# EAGLE design Swarm Board (EAGLE 6.2)
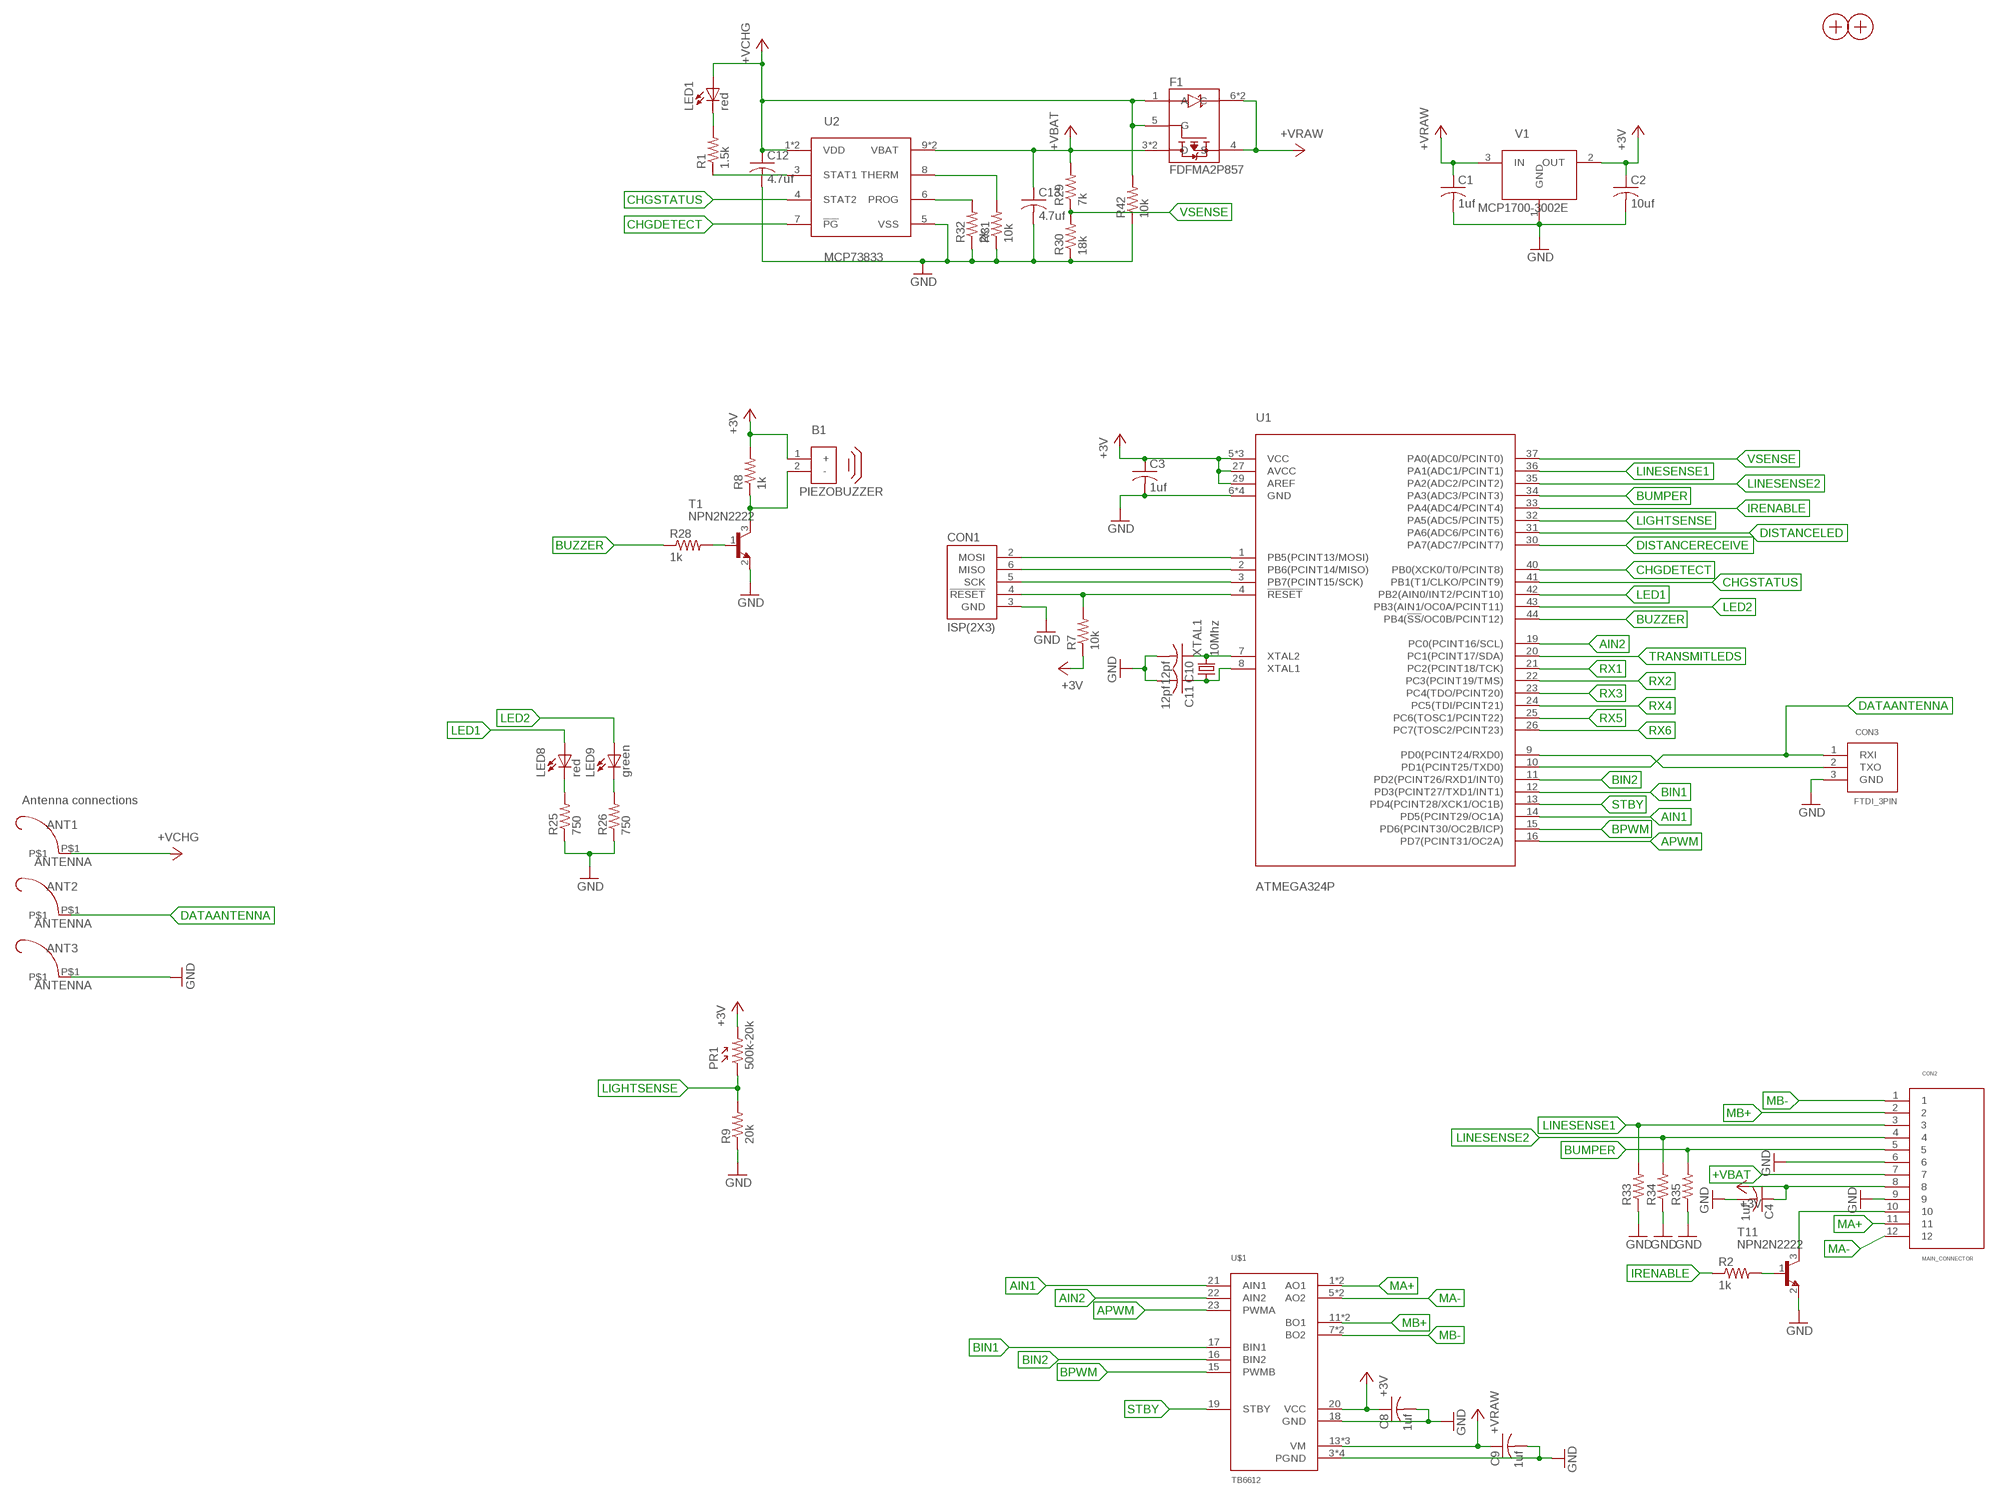
[diagram p0: schematic, sheet 1, part 1 of 2]
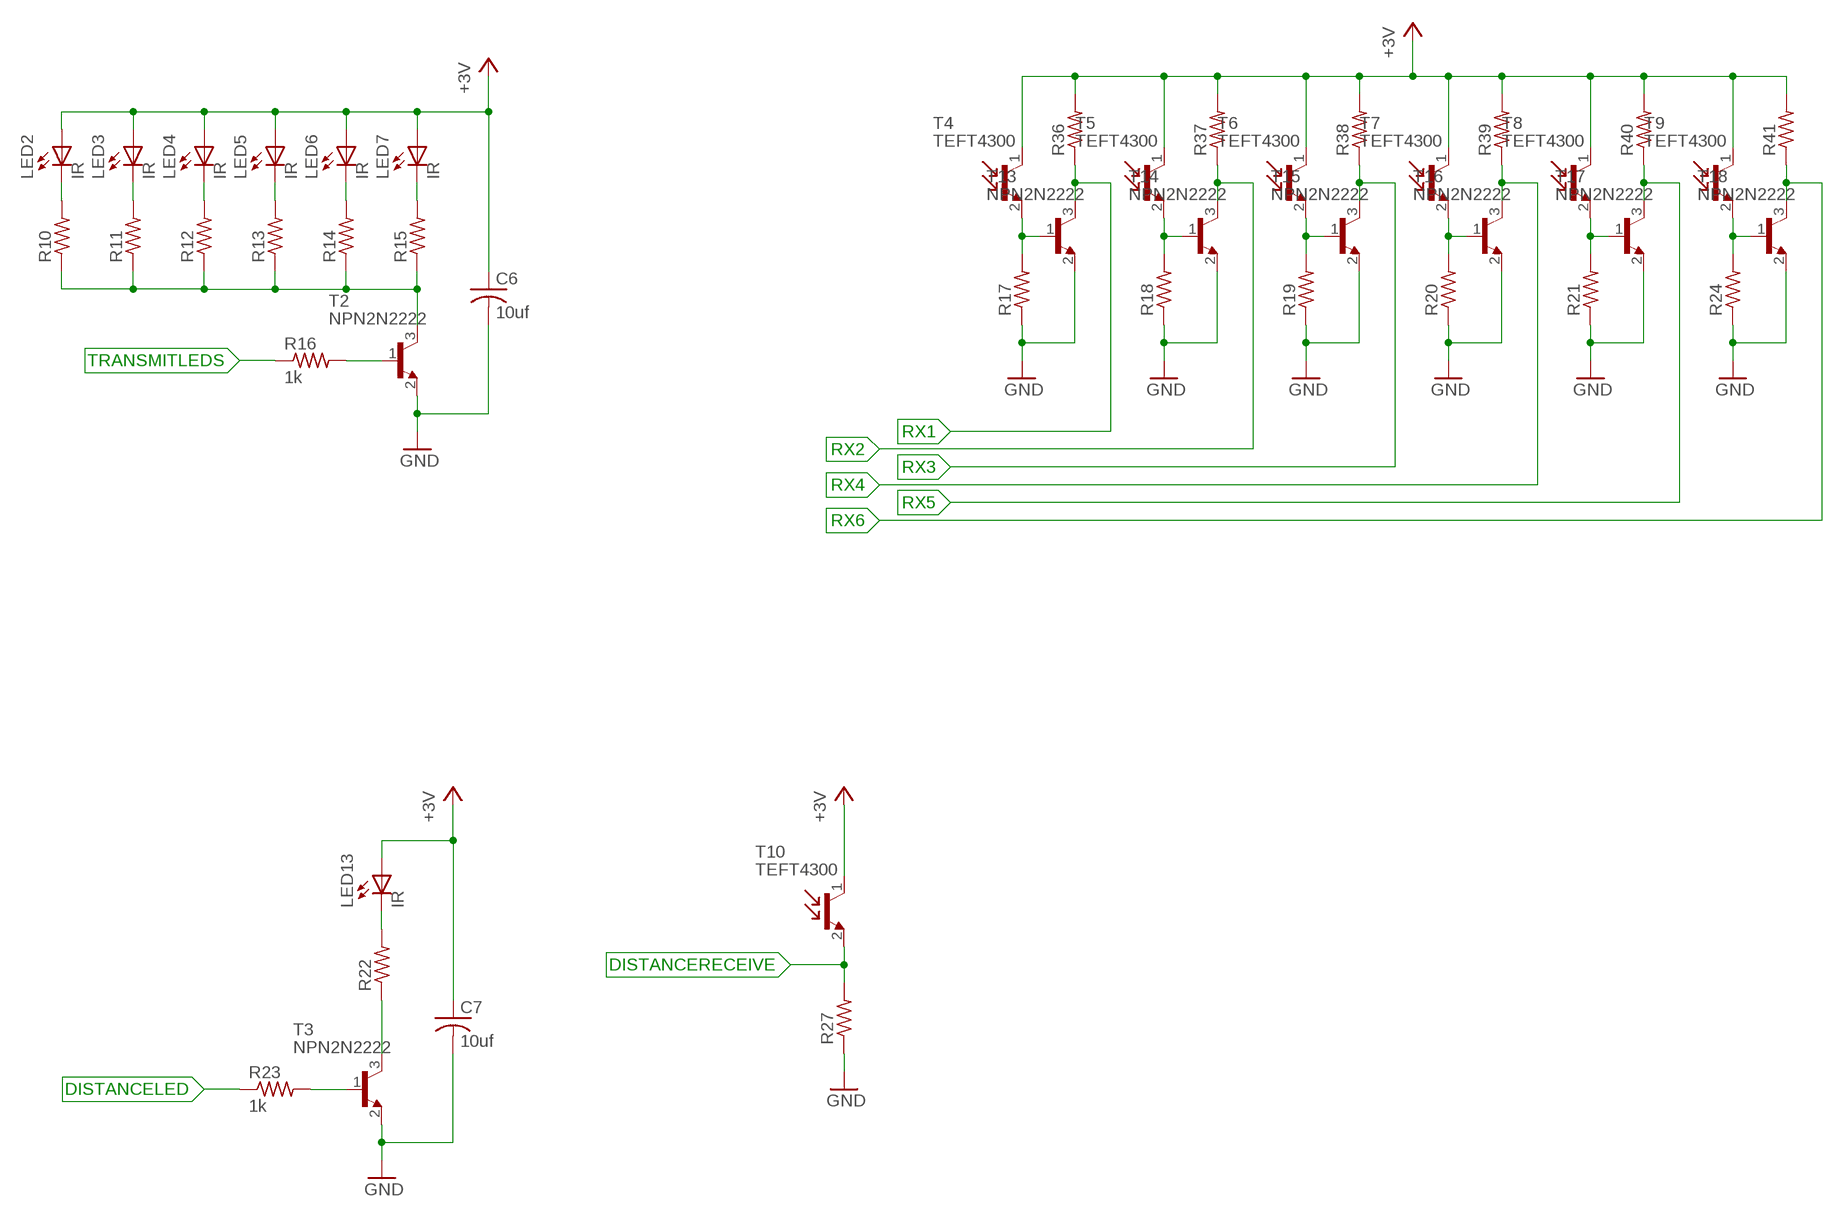
[diagram p1: schematic, sheet 1, part 2 of 2]

## Parts
ANT1  ANTENNA  [ANTENNA]
ANT2  ANTENNA  [ANTENNA]
ANT3  ANTENNA  [ANTENNA]
B1  PIEZOBUZZER  [PIEZOBUZZER]
C1  1uf  CAP0603  [0603]
C2  10uf  CAP0805  [0805]
C3  1uf  CAP0603  [0603]
C4  1uf  CAP0603  [0603]
C6  10uf  CAP0805  [0805]
C7  10uf  CAP0805  [0805]
C8  1uf  CAP0603  [0603]
C9  1uf  CAP0603  [0603]
C10  12pf  CAP0603  [0603]
C11  12pf  CAP0603  [0603]
C12  4.7uf  CAP0603  [0603]
C13  4.7uf  CAP0603  [0603]
CON1  ISP(2X3)  [PINHEADER(2X3)]
CON2  MAIN_CONNECTOR  [FEMALE_HEADER_2MM_2X6]
CON3  FTDI_3PIN  [3PINHEADER_.100"]
F1  FDFMA2P857  [MICROFET2X2MM]
H1  MOUNTINGHOLE  [MOUNTINGHOLE]
H2  MOUNTINGHOLE  [MOUNTINGHOLE]
LED1  red  LED0603  [LED0603]
LED2  IR  LED5MMRA  [5MM_LED_RA]
LED3  IR  LED5MMRA  [5MM_LED_RA]
LED4  IR  LED5MMRA  [5MM_LED_RA]
LED5  IR  LED5MMRA  [5MM_LED_RA]
LED6  IR  LED5MMRA  [5MM_LED_RA]
LED7  IR  LED5MMRA  [5MM_LED_RA]
LED8  red  LED0603  [LED0603]
LED9  green  LED0603  [LED0603]
LED13  IR  LED5MMRA  [5MM_LED_RA]
PR1  500k-20k  CDSPHOTORESISTOR  [CDSPHOTOCELL]
R1  1.5k  RES0603  [0603]
R2  1k  RES0603  [0603]
R7  10k  RES0603  [0603]
R8  1k  RES0603  [0603]
R9  20k  RES0603  [0603]
R10  RES0603  [0603]
R11  RES0603  [0603]
R12  RES0603  [0603]
R13  RES0603  [0603]
R14  RES0603  [0603]
R15  RES0603  [0603]
R16  1k  RES0603  [0603]
R17  RES0603  [0603]
R18  RES0603  [0603]
R19  RES0603  [0603]
R20  RES0603  [0603]
R21  RES0603  [0603]
R22  RES0603  [0603]
R23  1k  RES0603  [0603]
R24  RES0603  [0603]
R25  750  RES0603  [0603]
R26  750  RES0603  [0603]
R27  RES0603  [0603]
R28  1k  RES0603  [0603]
R29  7k  RES0603  [0603]
R30  18k  RES0603  [0603]
R31  10k  RES0603  [0603]
R32  2k  RES0603  [0603]
R33  RES0603  [0603]
R34  RES0603  [0603]
R35  RES0603  [0603]
R36  RES0603  [0603]
R37  RES0603  [0603]
R38  RES0603  [0603]
R39  RES0603  [0603]
R40  RES0603  [0603]
R41  RES0603  [0603]
R42  10k  RES0603  [0603]
T1  NPN2N2222  [SOT23]
T2  NPN2N2222  [SOT23]
T3  NPN2N2222  [SOT23]
T4  TEFT4300  [3MM_LED_RA]
T5  TEFT4300  [3MM_LED_RA]
T6  TEFT4300  [3MM_LED_RA]
T7  TEFT4300  [3MM_LED_RA]
T8  TEFT4300  [3MM_LED_RA]
T9  TEFT4300  [3MM_LED_RA]
T10  TEFT4300  [3MM_LED_RA]
T11  NPN2N2222  [SOT23]
T13  NPN2N2222  [SOT23]
T14  NPN2N2222  [SOT23]
T15  NPN2N2222  [SOT23]
T16  NPN2N2222  [SOT23]
T17  NPN2N2222  [SOT23]
T18  NPN2N2222  [SOT23]
U1  ATMEGA324P  [TQFP44]
U2  MCP73833  [MSOP10]
U$1  TB6612  [24SSOP]
V1  MCP1700-3002E  [(TT/NB)SOT-23(3PAD)]
XTAL1  10Mhz  NX5032GA-10.000000MHZ  [SMDXTAL]

## Nets
+3V: B1.1(+) C2.1 C3.1 C4.1 C6.1 C7.1 C8.1 CON2.8 LED2.1(A) LED3.1(A) LED4.1(A) LED5.1(A) LED6.1(A) LED7.1(A) LED13.1(A) PR1.2 R7.1 R8.2 R36.2 R37.2 R38.2 R39.2 R40.2 R41.2 T4.1(C) T5.1(C) T6.1(C) T7.1(C) T8.1(C) T9.1(C) T10.1(C) U1.5(VCC) U1.17(VCC) U1.27(AVCC) U1.29(AREF) U1.38(VCC) U$1.20(VCC) V1.2(OUT)
+VBAT: C13.1 CON2.7 F1.3(D) F1.8(D) R29.2 U2.9(VBAT) U2.10(VBAT)
+VCHG: ANT1.P$1 C12.1 F1.1(A) F1.5(G) LED1.2(A) R42.2 U2.1(VDD) U2.2(VDD)
+VRAW: C1.1 C9.1 F1.4(S) F1.6(C) F1.7(C) U$1.13(VM) U$1.14(VM) U$1.24(VM) V1.3(IN)
AIN1: U1.14(PD5(PCINT29/OC1A)) U$1.21(AIN1)
AIN2: U1.19(PC0(PCINT16/SCL)) U$1.22(AIN2)
APWM: U1.16(PD7(PCINT31/OC2A)) U$1.23(PWMA)
BIN1: U1.12(PD3(PCINT27/TXD1/INT1)) U$1.17(BIN1)
BIN2: U1.11(PD2(PCINT26/RXD1/INT0)) U$1.16(BIN2)
BPWM: U1.15(PD6(PCINT30/OC2B/ICP)) U$1.15(PWMB)
BUMPER: CON2.5 R35.2 U1.34(PA3(ADC3/PCINT3))
BUZZER: R28.1 U1.44(PB4(!SS!/OC0B/PCINT12))
CHGDETECT: U1.40(PB0(XCK0/T0/PCINT8)) U2.7(!PG)
CHGSTATUS: U1.41(PB1(T1/CLKO/PCINT9)) U2.4(STAT2)
DATAANTENNA: ANT2.P$1 CON3.1(RXI) U1.10(PD1(PCINT25/TXD0))
DISTANCELED: R23.1 U1.31(PA6(ADC6/PCINT6))
DISTANCERECEIVE: R27.2 T10.2(E) U1.30(PA7(ADC7/PCINT7))
GND: ANT3.P$1 C1.2 C2.2 C3.2 C4.2 C6.2 C7.2 C8.2 C9.2 C10.2 C11.2 C12.2 C13.2 CON1.3(GND) CON2.6 CON2.9 CON3.3(GND) R9.1 R17.1 R18.1 R19.1 R20.1 R21.1 R24.1 R25.1 R26.1 R27.1 R30.1 R31.1 R32.1 R33.1 R34.1 R35.1 R42.1 T1.2(E) T2.2(E) T3.2(E) T11.2(E) T13.2(E) T14.2(E) T15.2(E) T16.2(E) T17.2(E) T18.2(E) U1.6(GND) U1.18(GND) U1.28(GND) U1.39(GND) U2.5(VSS) U$1.3(PGND) U$1.4(PGND) U$1.9(PGND) U$1.10(PGND) U$1.18(GND) V1.1(GND)
IRENABLE: R2.1 U1.33(PA4(ADC4/PCINT4))
LED1: LED8.2(A) U1.42(PB2(AIN0/INT2/PCINT10))
LED2: LED9.2(A) U1.43(PB3(AIN1/OC0A/PCINT11))
LIGHTSENSE: PR1.1 R9.2 U1.32(PA5(ADC5/PCINT5))
LINESENSE1: CON2.3 R33.2 U1.36(PA1(ADC1/PCINT1))
LINESENSE2: CON2.4 R34.2 U1.35(PA2(ADC2/PCINT2))
MA+: CON2.11 U$1.1(AO1) U$1.2(AO1)
MA-: CON2.12 U$1.5(AO2) U$1.6(AO2)
MB+: CON2.2 U$1.11(BO1) U$1.12(BO1)
MB-: CON2.1 U$1.7(BO2) U$1.8(BO2)
N$1: LED1.1(C) R1.2
N$2: CON1.2(MOSI) U1.1(PB5(PCINT13/MOSI))
N$3: CON1.6(MISO) U1.2(PB6(PCINT14/MISO))
N$4: R2.2 T11.1(B)
N$5: CON1.5(SCK) U1.3(PB7(PCINT15/SCK))
N$6: CON1.4(!RESET) R7.2 U1.4(!RESET)
N$7: CON2.10 T11.3(C)
N$8: CON3.2(TXO) U1.9(PD0(PCINT24/RXD0))
N$9: B1.2(-) R8.1 T1.3(C)
N$10: R10.1 R11.1 R12.1 R13.1 R14.1 R15.1 T2.3(C)
N$11: R16.2 T2.1(B)
N$12: R22.1 T3.3(C)
N$13: LED2.2(C) R10.2
N$14: LED3.2(C) R11.2
N$15: LED4.2(C) R12.2
N$16: LED5.2(C) R13.2
N$17: LED6.2(C) R14.2
N$18: LED7.2(C) R15.2
N$19: R23.2 T3.1(B)
N$20: LED8.1(C) R25.2
N$21: LED9.1(C) R26.2
N$22: R31.2 U2.8(THERM)
N$23: C10.1 U1.7(XTAL2) XTAL1.2
N$24: C11.1 U1.8(XTAL1) XTAL1.1
N$25: LED13.2(C) R22.2
N$26: R28.2 T1.1(B)
N$27: R17.2 T4.2(E) T13.1(B)
N$28: R32.2 U2.6(PROG)
N$33: R1.1 U2.3(STAT1)
N$34: R24.2 T9.2(E) T18.1(B)
N$35: R21.2 T8.2(E) T17.1(B)
N$36: R20.2 T7.2(E) T16.1(B)
N$37: R19.2 T6.2(E) T15.1(B)
N$38: R18.2 T5.2(E) T14.1(B)
RX1: R36.1 T13.3(C) U1.21(PC2(PCINT18/TCK))
RX2: R37.1 T14.3(C) U1.22(PC3(PCINT19/TMS))
RX3: R38.1 T15.3(C) U1.23(PC4(TDO/PCINT20))
RX4: R39.1 T16.3(C) U1.24(PC5(TDI/PCINT21))
RX5: R40.1 T17.3(C) U1.25(PC6(TOSC1/PCINT22))
RX6: R41.1 T18.3(C) U1.26(PC7(TOSC2/PCINT23))
STBY: U1.13(PD4(PCINT28/XCK1/OC1B)) U$1.19(STBY)
TRANSMITLEDS: R16.1 U1.20(PC1(PCINT17/SDA))
VSENSE: R29.1 R30.2 U1.37(PA0(ADC0/PCINT0))

## Notes on the sheet
- Antenna connections

## Library data of the parts
ANT1-ANT3 = Mechanical:ANTENNA
B1 = Passive:PIEZOBUZZER: Digikey Part Number: 445-2525-1-ND Manufacturer Part Number: PS1240P02BT
C1-C4 C6-C13 = Passive:CAP
CON1 = Mechanical:ISP
CON2 = Mechanical:MAIN_CONNECTOR: Digikey Part Number: S5750-06-ND Manufacturer Part Number: NPPN062AFCN-RC
CON3 = Mechanical:FTDI_3PIN
F1 = Passive:FDFMA2P857: Digikey Part Number: FDFMA2P857CT-ND Manufacturer Part Number: FDFMA2P857
H1 H2 = Mechanical:MOUNTINGHOLE
LED1-LED9 LED13 = Passive:LED
PR1 = Passive:CDSPHOTORESISTOR: Digikey Part Number: PDV-P8103-ND Manufacturer Part Number: PDV-P8103
R1 R2 R7-R42 = Passive:RES
T1-T3 T11 T13-T18 = Passive:NPN2N2222: Digikey Part Number: 568-1738-1-ND Manufacturer Part Number: PMBT2222A,215
T4-T10 = Passive:TEFT4300: Digikey Part Number: 751-1041-ND Manufacturer Part number: TEFT4300
U1 = DigitalIC:ATMEGA324P: Digikey Part Number: ATMEGA324P-20AU-ND Manufacturer Part Number: ATMEGA324P-20AU
U2 = PowerIC:MCP73833: Manufacturer Part Number: MCP73833-AMI/UN Mouser Part Number: 579-MCP73833-AMI/UN
U$1 = DigitalIC:TB6612
V1 = PowerIC:MCP1700-3002E: Digikey Part Number: MCP1700T-3002E/TTCT-ND Manufacturer Part Number: MCP1700T-3002E/TT
XTAL1 = Passive:NX5032GA-10.000000MHZ: Digikey Part Number: 644-1033-1-ND Manufacturer Part Number: NX5032GA-10.000000MHZ-LN-CD-1

## Board
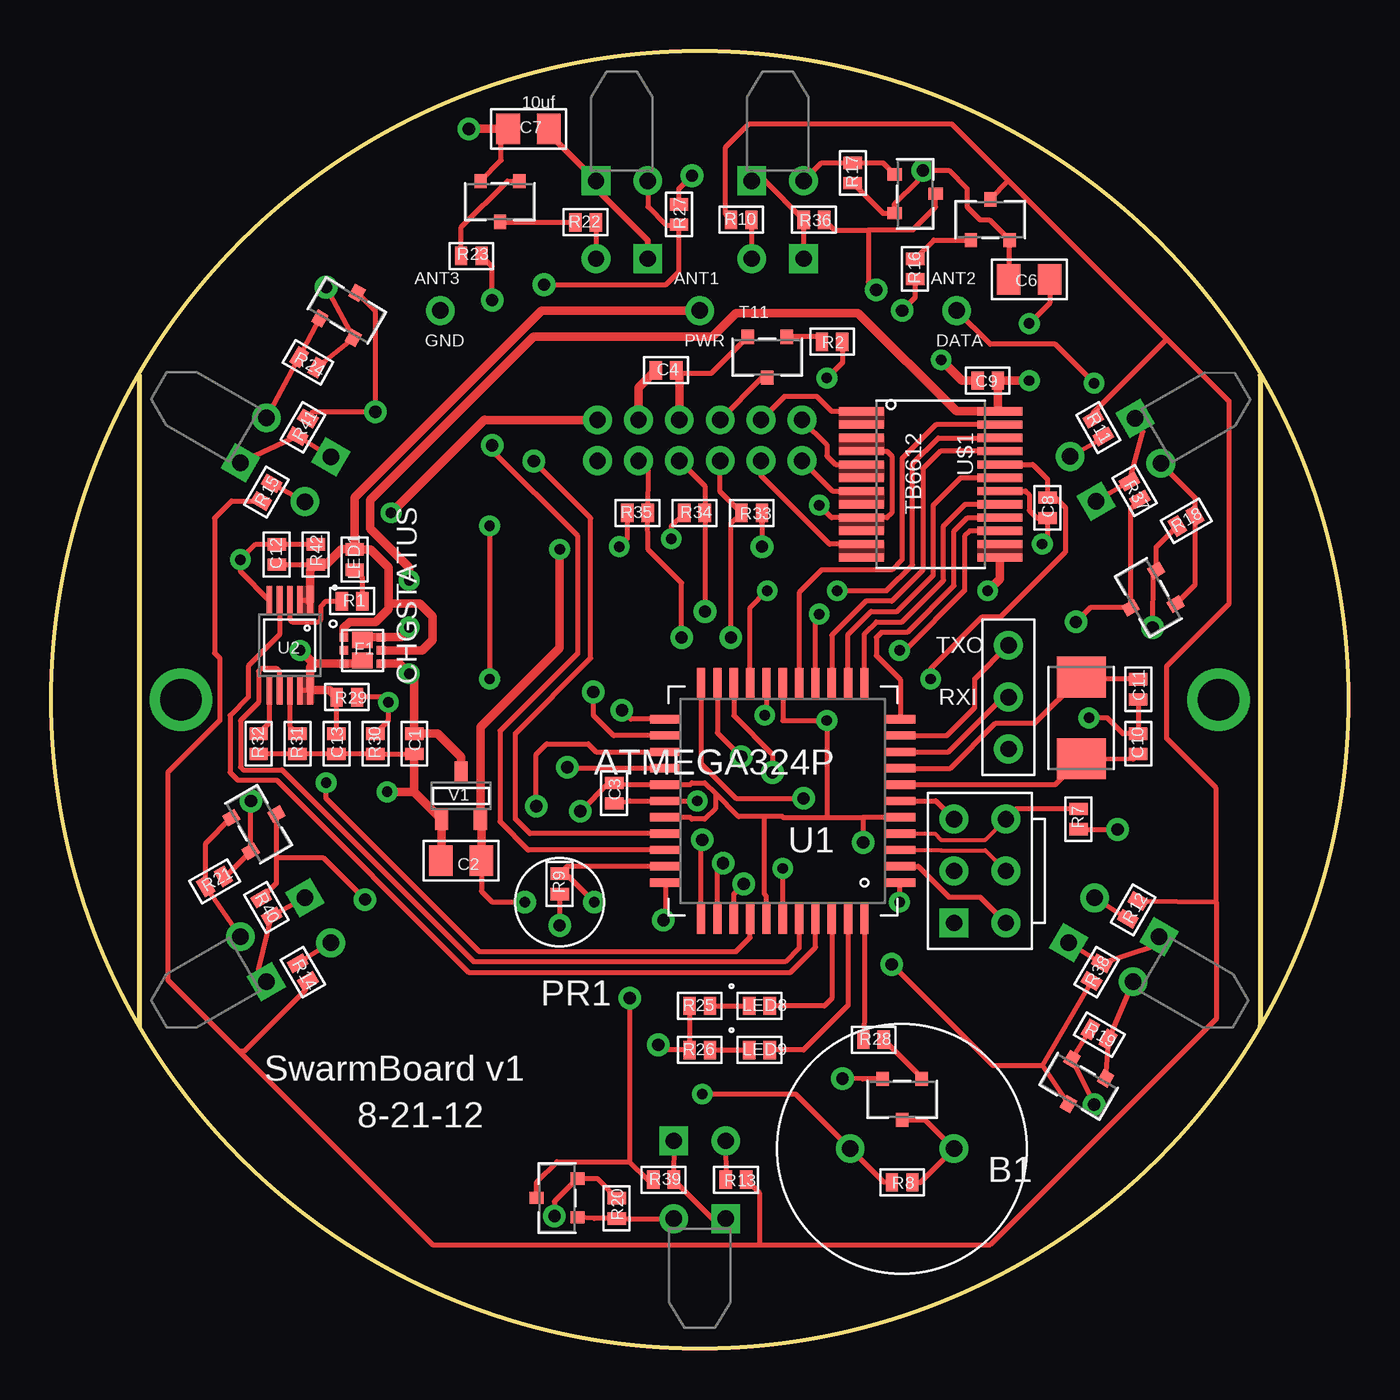
[diagram p2: board, top side]
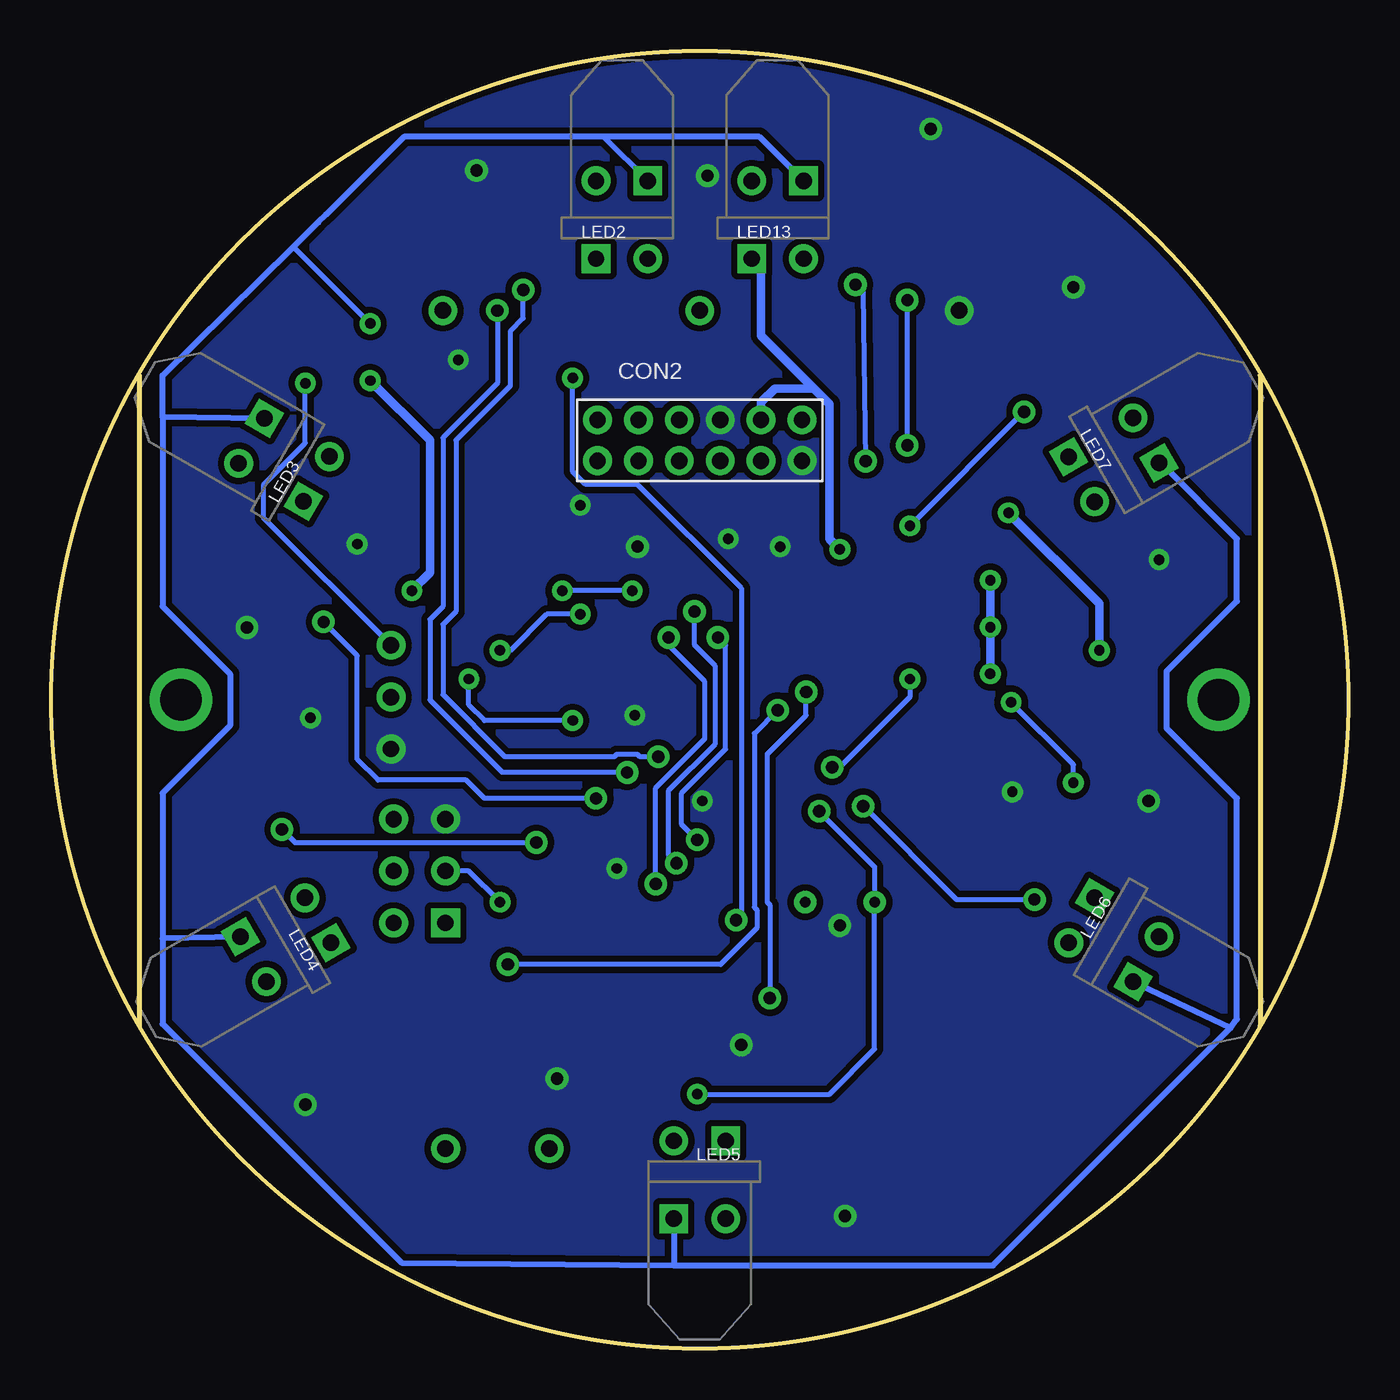
[diagram p3: board, bottom side, seen from below]

Size 63.5 x 63.5 mm. Coordinates in mm from the lower left corner, seen from the top.
Outline: 4.32,47.62 4.32,15.8
Outline: 59.18,47.62 59.18,15.8
Outline: circle at 31.75,31.75 radius 31.75
Copper layers (1*16): Top 0.035mm / dielectric 1.5mm / Bottom 0.035mm
Design rules: minimum track width 8mil, minimum drill 20mil, track to track 8mil, track to pad 8mil, pad to pad 8mil, via to via 8mil, smd to smd 8mil, copper to edge 10mil, drill to drill 8mil, minimum pad ring 12mil, minimum via ring 10mil, stop-mask expansion 4mil, vias tented up to drill 25mil, thermal gap 10mil

### Footprints (pad centres in the part's own frame; a part is rotated, then mirrored left to right if it is on the bottom)
ANTENNA = drill 0.8: P$1 0,0
PIEZOBUZZER = drill 0.8: 1 -2.54,0; 2 2.54,0
0603 = smd 0.6 x 0.9: 1 -0.5,0; 2 0.5,0
0805 = smd 1.15 x 1.5: 1 -1,0; 2 1,0
PINHEADER(2X3) = drill 0.8 square: 1 -2.54,1.27 | drill 0.8: 2 0,1.27; 3 2.54,1.27; 4 2.54,-1.27; 5 0,-1.27; 6 -2.54,-1.27
FEMALE_HEADER_2MM_2X6 = drill 0.8: 1 -5,-1; 2 -3,-1; 3 -1,-1; 4 1,-1; 5 3,-1; 6 5,-1; 7 5,1; 8 3,1; 9 1,1; 10 -1,1; 11 -3,1; 12 -5,1
3PINHEADER_.100" = drill 0.8: 1 -2.54,0; 2 0,0; 3 2.54,0
MICROFET2X2MM = smd 0.42 x 0.42: 1 -0.65,-0.915; 2 0,-0.915; 3 0.65,-0.915; 4 0.65,0.915; 5 0,0.915; 6 -0.65,0.915 | smd 0.78 x 1: 7 -0.5,0; 8 0.5,0
MOUNTINGHOLE = drill 2.032 pad 2.286: P$2 0,0
LED0603 = smd 0.6 x 0.9: 1 -0.5,0; 2 0.5,0
5MM_LED_RA = drill 0.8 square: 1 -1.27,0 | drill 0.8: 2 1.27,0
CDSPHOTOCELL = drill 0.508: 1 -1.694,0; 2 1.702,0
SOT23 = smd 0.6 x 0.7: 1 0.95,1; 2 -0.95,1; 3 0,-1
3MM_LED_RA = drill 0.8 square: 1 -1.27,0 | drill 0.8: 2 1.27,0
TQFP44 = smd 1.5 x 0.406: 1 -5.75,4; 2 -5.75,3.2; 3 -5.75,2.4; 4 -5.75,1.6; 5 -5.75,0.8; 6 -5.75,0; 7 -5.75,-0.8; 8 -5.75,-1.6; 9 -5.75,-2.4; 10 -5.75,-3.2; 11 -5.75,-4; 23 5.75,-4; 24 5.75,-3.2; 25 5.75,-2.4; 26 5.75,-1.6; 27 5.75,-0.8; 28 5.75,0; 29 5.75,0.8; 30 5.75,1.6; 31 5.75,2.4; 32 5.75,3.2; 33 5.75,4 | smd 0.406 x 1.5: 12 -4,-5.75; 13 -3.2,-5.75; 14 -2.4,-5.75; 15 -1.6,-5.75; 16 -0.8,-5.75; 17 0,-5.75; 18 0.8,-5.75; 19 1.6,-5.75; 20 2.4,-5.75; 21 3.2,-5.75; 22 4,-5.75; 34 4,5.75; 35 3.2,5.75; 36 2.4,5.75; 37 1.6,5.75; 38 0.8,5.75; 39 0,5.75; 40 -0.8,5.75; 41 -1.6,5.75; 42 -2.4,5.75; 43 -3.2,5.75; 44 -4,5.75
MSOP10 = smd 0.28 x 1.4: 1 -1,-2.2; 2 -0.5,-2.2; 3 0,-2.2; 4 0.5,-2.2; 5 1,-2.2; 6 1,2.2; 7 0.5,2.2; 8 0,2.2; 9 -0.5,2.2; 10 -1,2.2
24SSOP = smd 0.4 x 2.2: 1 -3.575,-3.378; 2 -2.925,-3.378; 3 -2.275,-3.378; 4 -1.625,-3.378; 5 -0.975,-3.378; 6 -0.325,-3.378; 7 0.325,-3.378; 8 0.975,-3.378; 9 1.625,-3.378; 10 2.275,-3.378; 11 2.925,-3.378; 12 3.575,-3.378; 13 3.575,3.378; 14 2.925,3.378; 15 2.275,3.378; 16 1.625,3.378; 17 0.975,3.378; 18 0.325,3.378; 19 -0.325,3.378; 20 -0.975,3.378; 21 -1.625,3.378; 22 -2.275,3.378; 23 -2.925,3.378; 24 -3.575,3.378
(TT/NB)SOT-23(3PAD) = smd 0.65 x 1.05: 1 -0.95,-1.15; 2 0.95,-1.15; 3 0,1.15
SMDXTAL = smd 2 x 2.4: 1 -2,0; 2 2,0

### Placement (x,y rotation side)
ANT1  31.75,50.8 0 top
ANT2  44.32,50.8 0 top
ANT3  19.05,50.8 0 top
B1  41.66,9.78 0 top
C1  17.78,29.59 270 top
C2  20.07,23.88 180 top
C3  27.56,27.18 270 top
C4  30.1,47.88 0 top
C6  47.88,52.32 180 top
C7  23.37,59.69 180 top
C8  48.77,41.15 270 top
C9  45.85,47.37 180 top
C10  53.21,29.59 90 top
C11  53.21,32.26 270 top
C12  11.05,38.86 90 top
C13  13.97,29.59 270 top
CON1  45.47,23.37 90 top
CON2  31.75,44.45 0 bottom
CON3  46.86,31.88 270 top
F1  15.24,34.16 270 top
H1  6.35,31.75 0 top
H2  57.15,31.75 0 top
LED1  14.86,38.61 90 top
LED2  35.56,53.34 0 bottom
LED3  50.51,42.56 60 bottom
LED4  50.44,20.95 120 bottom
LED5  31.75,10.16 180 bottom
LED6  13.06,20.95 240 bottom
LED7  13.06,42.55 300 bottom
LED8  34.67,16.76 0 top
LED9  34.67,14.61 0 top
LED13  27.94,53.34 0 bottom
PR1  24.89,21.84 180 top
R1  14.73,36.58 0 top
R2  38.23,49.28 180 top
R7  50.29,25.91 90 top
R8  41.66,8.13 180 top
R9  24.89,22.73 90 top
R10  33.78,55.24 0 top
R11  51.26,45.07 300 top
R12  52.96,21.46 240 top
R13  33.53,8.26 180 top
R14  12.32,18.41 120 top
R15  10.54,41.91 60 top
R16  42.29,52.83 90 top
R17  39.24,57.53 90 top
R18  55.56,40.51 30 top
R19  51.31,15.37 330 top
R20  27.69,6.86 270 top
R21  8,22.86 210 top
R22  26.16,55.12 0 top
R23  20.57,53.47 180 top
R24  12.57,48.26 150 top
R25  31.75,16.76 0 top
R26  31.75,14.61 0 top
R27  30.73,55.5 270 top
R28  40.26,15.11 0 top
R29  14.48,31.88 180 top
R30  15.88,29.59 90 top
R31  12.06,29.59 90 top
R32  10.16,29.59 90 top
R33  34.29,40.89 180 top
R34  31.5,40.89 0 top
R35  28.7,40.89 0 top
R36  37.34,55.24 180 top
R37  53.04,41.99 120 top
R38  51.18,18.41 60 top
R39  29.97,8.26 0 top
R40  10.54,21.59 300 top
R41  12.32,45.09 240 top
R42  12.95,38.86 270 top
T1  41.66,12.19 0 top
T2  45.97,55.24 180 top
T3  21.97,56.13 0 top
T4  35.56,57.15 0 top
T5  53.69,44.42 300 top
T6  53.59,19.05 240 top
T7  31.75,6.35 180 top
T8  9.91,19.05 120 top
T9  9.91,44.45 60 top
T10  27.94,57.15 0 top
T11  35.05,48.51 0 top
T13  42.29,56.52 90 top
T14  53.71,36.75 300 top
T15  50.29,12.83 330 top
T16  24.77,7.37 270 top
T17  10.16,25.65 120 top
T18  14.48,50.8 150 top
U1  35.81,26.8 180 top
U2  11.68,34.42 180 top
U$1  43.05,42.29 270 top
V1  20.07,27.05 0 top
XTAL1  50.42,30.86 270 top

### Tracks (layer width: path | path; a pad name or v marks a point on that pad's centre or on a via)
+3V  (via drill 0.51, 0.6 pad 0.41)
  Top 0.254: 32.51,27.18 32,27.69 31.37,27.69 31.28,27.6 U1.27 28.27,27.6 C3.1 27.3,27.68 v25.91,26.29 | 32.51,27.18 32.51,26.42 32,25.91 31.37,25.91 31.28,26 U1.29 | 32.51,27.18 33.66,26.04 34.92,26.04 | 37.97,26 35.81,26 35.81,26.04 34.92,26.04 | 37.97,26 39.75,26 | U1.38 35.01,22.14 34.92,22.23 34.92,26.04 | LED2.1 R36.2 34.93,57.15 T4.1 | LED3.1 51.15,41.48 R37.2 53.44,44.85 T5.1 | LED4.1 R38.2 53.98,19.68 T6.1 | LED5.1 R39.2 32.38,6.35 T7.1 | LED6.1 R40.2 10.16,18.54 T8.1 | LED7.1 R41.2 T9.1 | R8.2 40.76,8.14 B1.1 36.45,12.45 v31.88,12.45 | U1.5 39.75,26 | R7.1 v52.2,25.4 | v39.75,24.77 39.75,26 | 37.97,26 v37.97,30.73 35.81,30.73 U1.17 | C2.1 21.07,22.37 21.59,21.84 PR1.2 | C6.1 48.88,51.16 v47.88,50.16 | v43.05,32.77 43.05,33.27 45.59,35.81 46.48,35.81 49.66,38.99 49.66,41.15 49.16,41.65 C8.1 48.77,42.55 48.05,43.27 U$1.20
  Top 0.305: LED13.1 29.21,54.23 26.67,56.77 T10.1 24.51,59.31 C7.1
  Top 0.406: CON2.8 28.75,47.03 C4.1 | v24.89,39.12 24.89,34.29 21.02,30.41 V1.2 21.07,25.85 C2.1
  Bottom 0.254: 36.45,59.31 T4.1 | 9.19,43.35 T9.1 | v52.2,25.4 51.56,24.77 v39.75,24.77 | v25.91,26.29 23.19,23.57 PR1.2 23.19,14.66 25.4,12.45 v31.88,12.45 | v47.88,50.16 51.57,53.85 51.7,53.85 | v37.97,30.73 42.29,30.73 43.05,31.5 v43.05,32.77
  Bottom 0.305: T10.1 28.83,59.31 36.45,59.31 46.23,59.31 50.04,55.5 50.42,55.12 51.7,53.85 58.04,47.62 58.04,45.59 | 58.04,45.59 58.04,36.32 54.74,33.02 54.74,30.48 58.04,27.18 58.04,20.07 | 58.04,20.07 58.04,15.88 46.35,4.19 33.02,4.06 | 33.02,4.06 17.4,4.06 5.78,15.68 | 5.78,15.68 5.46,16.13 5.46,26.92 8.89,30.35 8.89,33.15 5.46,36.58 5.46,39.62 9.19,43.35 | T5.1 58.04,45.59 | T6.1 58.04,20.07 | T7.1 33.02,4.06 | T8.1 5.78,15.68
  Bottom 0.406: CON2.8 28.75,46.31 28.07,46.99 26.16,46.99 | 26.16,46.99 25.4,46.23 25.4,39.62 v24.89,39.12 | 26.16,46.99 28.75,49.58 28.75,52.88 LED13.1
+VBAT  (via drill 0.51)
  Top 0.254: U2.9 U2.10 | C13.1 13.97,31.61 R29.2
  Top 0.406: CON2.7 21.21,45.45 21.23,45.47 v16.64,40.89 | 12.84,33.51 F1.3 15.09,33.51 F1.8 | 12.84,33.51 v12.19,34.16 | R29.2 13.64,32.22 U2.10 12.68,33.35 12.84,33.51
  Bottom 0.406: v12.19,34.16 12.19,36.45 v16.64,40.89
  pour Top (no thermals): 12.19,32.83 12.76,32.83 12.76,31.62 12.19,31.62
+VCHG
  Top 0.254: 12.57,36.51 U2.1 U2.2 | 14.6,39.11 LED1.2 | C12.1 R42.2
  Top 0.406: ANT1.P$1 24,50.8 14.86,41.66 LED1.2 15.63,39.11 16.51,38.23 16.51,36.45 | F1.5 18.16,34.16 18.67,34.67 18.67,35.81 18.03,36.45 16.51,36.45 | F1.1 14.32,35.28 14.61,35.56 15.88,35.56 16.51,36.2 16.51,36.45 | LED1.2 14.22,39.12 13.47,38.36 R42.2 12.68,38.09 U2.1
  pour Top (no thermals): 12.19,37.21 12.76,37.21 12.76,36 12.19,36
+VRAW  (via drill 0.51)
  Top 0.254: 15.52,34.81 F1.7
  Top 0.406: 15.52,34.81 F1.6 17.16,34.81 v17.53,35.31 | F1.4 17.04,33.51 v17.53,33.02 17.78,32.77 C1.1 17.91,30.1 18.92,30.1 20.07,28.96 V1.3 | v17.53,37.59 17.53,38.23 15.62,40.13 15.62,41.53 23.62,49.53 32.38,49.53 33.53,50.67 39.5,50.67 44.3,45.87 U$1.24 46.35,45.95 C9.1 v47.88,47.37 | v45.85,37.08 46.43,37.67 U$1.13
  Bottom 0.406: v17.53,33.02 17.53,34.41 v17.53,35.31 v17.53,37.59 | v47.88,47.37 44.96,44.45 44.96,37.97 v45.85,37.08
  pour Top (no thermals): 47.41,39.45 47.41,38.65 45.45,38.65 45.45,39.45
AIN1
  Top 0.254: U$1.21 43.53,43.92 42.67,43.05 42.67,38.1 41.15,36.58 39.88,36.58 38.21,34.91 U1.14
AIN2  (via drill 0.51)
  Top 0.254: U1.19 34.21,36.25 v35.05,37.08 | v38.48,37.08 40.89,37.08 42.16,38.35 42.16,43.31 43.42,44.57 U$1.22
  Bottom 0.254: v35.05,37.08 v38.48,37.08
APWM
  Top 0.254: U$1.23 43.31,45.22 41.66,43.56 41.66,38.61 41.15,38.1 37.72,38.1 36.61,36.99 U1.16
BIN1
  Top 0.254: U1.12 39.81,34.99 40.39,35.56 41.66,35.56 43.69,37.59 43.69,40.26 44.74,41.32 U$1.17
BIN2
  Top 0.254: U$1.16 44.86,40.67 44.2,40.01 44.2,37.34 41.91,35.05 40.64,35.05 40.39,34.8 40.39,33.91 41.56,32.73 U1.11
BPWM  (via drill 0.51)
  Top 0.254: U1.15 37.41,35.76 v37.59,35.94 | U$1.15 44.97,40.02 44.7,39.75 44.7,37.08 41.78,34.16 v41.53,34.16
  Bottom 0.254: v37.59,35.94 39.24,35.94 41.02,34.16 v41.53,34.16
BUMPER  (via drill 0.6 pad 0.41)
  Top 0.254: U1.34 31.81,24.83 v31.88,24.89 | v30.86,34.8 30.86,37.47 29.22,39.11 R35.2 29.22,42.98 CON2.5
  Bottom 0.254: v31.88,24.89 32.64,25.65 32.64,27.18 30.48,29.34 30.48,34.42 v30.86,34.8
BUZZER
  Top 0.254: U1.44 39.81,16.2 R28.1
CHGDETECT
  Top 0.254: U2.7 11.18,33.14 11.05,33.27 10.29,33.27 10.16,33.15 10.16,31.62 9.27,30.73 9.27,28.45 9.4,28.32 11.3,28.32 20.7,18.92 35.94,18.92 36.61,19.6 U1.40
CHGSTATUS
  Top 0.254: U2.4 11.18,34.93 9.65,33.4 9.65,31.88 8.76,30.99 8.76,28.19 9.14,27.81 11.05,27.81 20.45,18.41 36.2,18.41 37.41,19.63 U1.41
DATAANTENNA  (via drill 0.51)
  Top 0.254: U1.10 43.84,30 45.21,31.37 45.21,32.77 CON3.1 | v51.05,47.24 49.15,49.15 45.97,49.15 ANT2.P$1
  Bottom 0.254: CON3.1 53.09,40.64 53.09,42.29 51.05,44.32 v51.05,47.24
DISTANCELED  (via drill 0.6 pad 0.41)
  Top 0.254: U1.31 23.36,24.4 21.97,25.78 21.97,30.23 25.78,34.04 25.78,39.75 21.59,43.94 v21.59,44.2 | v21.59,51.31 21.59,52.95 R23.1
  Bottom 0.254: v21.59,44.2 v21.59,51.31
DISTANCERECEIVE  (via drill 0.6 pad 0.41)
  Top 0.254: T10.2 29.21,55.88 30.1,54.99 R27.2 30.73,52.7 30.1,52.07 v24.13,52.07 | U1.30 23.44,25.2 22.73,25.91 22.73,30.1 26.42,33.78 26.42,40.64 v23.62,43.43
  Bottom 0.254: v23.62,43.43 23.75,51.69 v24.13,52.07
GND  (via drill 0.51, 0.6 pad 0.41, 0.6 pad 0.51)
  Top 0.254: U1.6 43.31,26.8 CON1.3 | C11.2 C10.2 52.46,30.09 51.69,30.86 v50.8,30.86 | U1.18 35.01,31.08 v34.92,30.99 | v31.62,26.8 U1.28 28.31,26.8 C3.2 | U1.39 v35.81,23.5 | v53.91,35.28 53.94,37.93 T14.2 54.1,39.23 R18.1 | R27.1 30.73,56.77 v31.37,57.4 | R19.1 T15.2 v51.05,11.94 | 27.87,7.43 R20.1 26.73,8.32 T16.2 24.64,7.19 v24.64,6.48 | R24.1 T18.2 v13.46,51.94 | v9.78,26.8 T17.2 8.55,23.11 R21.1 | T1.2 39.73,13.19 v38.73,13.21 | R25.1 R26.1 29.97,14.61 v29.72,14.86 | R9.1 v24.89,20.7 | C7.2 22.04,59.26 22.04,58.15 T3.2 | v34.8,39.24 34.8,40.38 34.79,40.39 R33.1 | R32.1 R31.1 C13.2 R30.1 C1.2 | v30.35,39.62 30.35,40.25 R34.1 | R35.1 28.2,39.63 v27.81,39.24 | 30.75,47.73 32.32,47.73 T11.2 | R17.1 40.71,55.56 T13.2 41.29,56.02 42.42,57.15 42.42,57.4 v42.67,57.66 43.94,57.66 44.83,56.77 44.83,55.88 45.47,55.24 45.92,55.24 T2.2 46.88,54.2 C6.2 | U2.5 9.27,38.03 v9.27,38.61 10.03,39.36 C12.2 R42.1 | U$1.4 40.92,43.92 41.15,43.69 41.15,40.89 40.92,40.67 U$1.9 38.2,40.67 v37.59,41.27 | U$1.18 47.7,41.97 47.88,41.78 47.88,41.02 48.25,40.65 C8.2 48.77,39.62 v48.51,39.37
  Top 0.406: C7.2 v20.45,59.69 | 30.73,47.63 C4.2 30.75,47.73 CON2.9 | C2.2 19.12,23.93 V1.1 17.78,27.24 | 17.78,27.24 v16.45,27.24 | 17.78,27.24 C1.2 | C9.2 44.58,47.37 v43.56,48.39
  Bottom 0.254: v30.35,39.62 30.48,39.62 | v37.59,41.27 37.34,41.27
  pour Bottom (isolate 0.305, no thermals): 16,61.21 27.43,66.29 46.99,63.25 62.74,47.24 66.8,26.42 55.12,4.06 27.69,-4.06 4.06,8.64 -1.91,28.07 -0.64,48.01 13.46,60.2
  pour Top (no thermals): 40.67,44.63 40.67,43.84 38.7,43.84 38.7,44.64
  pour Top (no thermals): 40.67,40.74 40.67,39.94 38.7,39.94 38.7,40.74
IRENABLE  (via drill 0.51, 0.6 pad 0.41)
  Top 0.254: U1.33 30.06,21.05 v29.97,20.95 | R2.1 38.73,48.26 v37.97,47.5
  Bottom 0.254: v37.97,47.5 37.97,42.93 37.34,42.29 34.8,42.29 29.72,37.21 29.72,21.21 v29.97,20.95
LED1
  Top 0.254: U1.42 38.21,17.13 37.85,16.76 LED8.2
LED2
  Top 0.254: U1.43 39.01,16.79 36.83,14.61 LED9.2
LIGHTSENSE
  Top 0.254: PR1.1 25.2,23.23 R9.2 25.26,23.6 U1.32
LINESENSE1  (via drill 0.6 pad 0.41)
  Top 0.254: U1.36 33.41,22.24 v33.91,22.73 | v33.27,34.8 33.27,40.39 R33.2 32.75,41.93 CON2.3
  Bottom 0.254: v33.91,22.73 33.91,27.43 31.5,29.84 31.5,32.64 33.27,34.42 v33.27,34.8
LINESENSE2  (via drill 0.6 pad 0.41)
  Top 0.254: U1.35 32.61,23.47 v32.89,23.75 | CON2.4 32,42.2 R34.2 32,40.63 v32,36.07
  Bottom 0.254: v32.89,23.75 33.27,24.13 33.27,27.3 30.99,29.59 30.99,33.4 32,34.42 v32,36.07
MA+
  Top 0.254: CON2.11 35.91,46.61 37.47,46.61 38.21,45.87 U$1.1
  pour Top (no thermals): 40.67,45.94 40.67,45.15 38.7,45.15 38.7,45.95
MA-
  Top 0.254: CON2.12 37.97,44.23 37.97,43.69 38.4,43.27 U$1.5
  pour Top (no thermals): 40.67,43.34 40.67,42.55 38.7,42.55 38.7,43.35
MB+
  Top 0.254: U$1.11 38.1,39.37 34.75,42.72 CON2.2
  pour Top (no thermals): 40.67,39.44 40.67,38.65 38.7,38.65 38.7,39.45
MB-
  Top 0.254: CON2.1 38.23,41.97 U$1.7
  pour Top (no thermals): 40.67,42.03 40.67,41.24 38.7,41.24 38.7,42.04
N$1
  Top 0.254: LED1.1 15.23,37.73 R1.2
N$2  (via drill 0.51)
  Top 0.203: U1.1 41.53,22.76
  Top 0.254: 41.53,22.76 v41.53,21.84
  Bottom 0.254: v41.53,21.84 43.05,23.37 CON1.2
N$3
  Top 0.254: U1.2 42.44,23.6 43.94,22.1 45.47,22.1 CON1.6
N$4
  Top 0.254: R2.2 37.51,49.53 T11.1
N$5
  Top 0.203: U1.3 43.45,24.4 43.56,24.38 45.72,24.38 CON1.5
N$6
  Top 0.203: U1.4 43.26,25.2 43.56,24.89 45.72,24.89 CON1.4
  Top 0.254: R7.2 47.24,26.41 CON1.4
N$7
  Top 0.254: T11.3 34.78,47.5 CON2.10
N$8
  Top 0.254: U1.9 43.93,29.2 46.61,31.88 CON3.2
N$9
  Top 0.254: R8.1 42.55,8.13 B1.2 42.78,11.19 T1.3
N$10
  Top 0.254: R10.1 33.02,55.5 33.02,58.8 34.16,59.94 44.07,59.94 46.86,57.15 | R11.1 51.01,45.8 54.61,49.4 | R12.1 57.02,21.84 | R14.1 12.45,17.53 9.46,14.54 9.21,14.54 | 9.21,14.54 5.71,18.03 5.71,28.19 8.26,30.73 8.26,33.78 8,34.04 8,40.64 8.84,41.48 R15.1 | 9.21,14.54 18.67,5.08 34.67,5.08 | 34.67,5.08 45.97,5.08 57.02,16.13 57.02,21.84 | R13.1 34.67,7.61 34.67,5.08 | 57.02,21.84 57.02,27.43 54.61,29.84 54.61,33.4 57.66,36.45 57.66,46.35 54.61,49.4 | 46.86,57.15 54.61,49.4 | T2.3 45.97,56.26 46.86,57.15
N$11
  Top 0.254: R16.2 43.2,54.24 T2.1
N$12
  Top 0.254: R22.1 22.37,55.12 T3.3
N$13
  Top 0.254: R10.2 LED2.2
N$14
  Top 0.254: LED3.2 51.5,44.59 R11.2
N$15
  Top 0.254: LED4.2 R12.2
N$16
  Top 0.254: LED5.2 R13.2
N$17
  Top 0.254: LED6.2 R14.2
N$18
  Top 0.254: R15.2 LED7.2
N$19
  Top 0.254: R23.2 20.07,54.87 22.34,57.13 T3.1
N$20
  Top 0.254: R25.2 LED8.1
N$21
  Top 0.254: R26.2 LED9.1
N$22
  Top 0.254: U2.8 11.68,30.47 R31.2
N$23
  Top 0.254: U1.7 49.16,27.6 XTAL1.2 52.96,28.84 C10.1
N$24
  Top 0.254: U1.8 44.02,28.4 46.23,30.61 48.16,30.61 XTAL1.1 51.18,32.76 C11.1
N$25
  Top 0.254: R22.2 LED13.2
N$26
  Top 0.254: T1.1 42.73,13.14 R28.2
N$27
  Top 0.254: T13.1 40.73,58.03 R17.2 37.71,58.03 T4.2
N$28
  Top 0.254: U2.6 10.68,30.61 R32.2
N$33
  Top 0.254: U2.3 11.68,35.69 11.81,35.56 13.08,35.56 13.21,35.69 13.21,36.32 13.46,36.58 R1.1
N$34
  Top 0.254: T9.2 R24.2 T18.1
N$35
  Top 0.254: T8.2 R21.2 7.57,24.73 T17.1
N$36
  Top 0.254: T7.2 27.95,6.35 R20.2 26.59,6.36 T16.1
N$37
  Top 0.254: T6.2 R19.2 T15.1
N$38
  Top 0.254: T5.2 55.99,41.65 R18.2 55.99,37.38 T14.1
RX1  (via drill 0.6 pad 0.41)
  Top 0.254: 40.01,54.74 42.16,54.74 43.29,55.86 T13.3 | R36.1 38.35,54.74 40.01,54.74 | U1.21 32.61,30.12 v33.78,28.96 | 40.01,54.74 40.01,52.2 v40.39,51.82
  Bottom 0.254: v33.78,28.96 34.67,28.96 34.8,29.08 35.81,29.08 35.94,28.96 41.27,28.96 44.32,32 44.32,35.43 43.69,36.07 43.69,44.45 41.02,47.12 41.02,49.78 40.39,50.42 v40.39,51.82
RX2  (via drill 0.6 pad 0.41)
  Top 0.254: U1.22 31.81,28.64 33.53,26.92 v36.83,26.92 | R37.1 52.84,41.11 T14.3 50.86,36.25 v50.16,35.56
  Bottom 0.254: v36.83,26.92 42.29,26.92 43.18,27.81 47.5,27.81 48.51,28.83 48.51,33.91 v50.16,35.56
RX3  (via drill 0.6 pad 0.41)
  Top 0.254: R38.1 48.51,13.84 | 48.51,13.84 T15.3 | U1.23 28.38,30.8 v27.94,31.24 | v41.15,18.8 46.1,13.84 48.51,13.84
  Bottom 0.254: v27.94,31.24 29.08,30.1 29.08,21.59 28.96,21.46 28.96,20.57 30.73,18.8 v41.15,18.8
RX4  (via drill 0.6 pad 0.41)
  Top 0.254: T16.3 23.77,8.14 24.77,9.14 28.32,9.14 | R39.1 29.21,8.26 28.32,9.14 | U1.24 27.53,30 26.54,30.99 v26.54,32.13 | v28.32,17.14 28.32,9.14
  Bottom 0.254: v28.32,17.14 28.32,21.72 28.45,21.84 28.45,29.08 26.54,30.99 v26.54,32.13
RX5  (via drill 0.6 pad 0.41)
  Top 0.254: v23.75,26.54 23.75,29.08 24.26,29.59 26.29,29.59 26.68,29.2 U1.25 | T17.3 11.03,24 | 11.03,24 11.03,22.76 R40.1 | v15.37,21.97 13.34,24 11.03,24
  Bottom 0.254: v23.75,26.54 19.18,21.97 v15.37,21.97
RX6  (via drill 0.51, 0.6 pad 0.41)
  Top 0.254: T18.3 15.88,50.77 v15.88,45.85 12.83,45.85 12.7,45.72 R41.1 | U1.26 25.35,28.4 v25.27,28.45 | v21.46,40.26 v21.46,32.77
  Bottom 0.254: v15.88,45.85 v21.46,40.26 | v25.27,28.45 24.89,28.45 21.46,31.88 v21.46,32.77
STBY
  Top 0.254: U1.13 39.01,34.95 40.13,36.07 41.4,36.07 43.18,37.85 43.18,41.27 44.52,42.62 U$1.19
TRANSMITLEDS  (via drill 0.6 pad 0.41)
  Top 0.254: U1.20 33.41,30.98 35.31,29.08 v35.31,28.19 | R16.1 42.29,51.44 v41.66,50.8
  Bottom 0.254: v35.31,28.19 41.4,28.19 44.96,31.75 44.96,35.69 44.32,36.32 44.32,44.58 41.66,47.24 v41.66,50.8
VSENSE  (via drill 0.51)
  Top 0.254: U1.37 34.21,20.12 33.53,19.43 20.95,19.43 13.46,26.92 v13.46,27.69 | 15.05,31.62 R29.1 16.26,31.88 v16.51,31.62 16.51,30.73 R30.2
  Bottom 0.254: v13.46,27.69 13.46,28.57 v16.51,31.62

### Text on the board
tPlace: GND | PWR | DATA | TXO | CHGSTATUS | RXI | SwarmBoard v1 | 8-21-12